# Altium schematic sheet Y181119---ArduinoNanoMCUATmega328P-DIP---9VDC.SchDoc
size 420 x 297 mm; Ratio: 1:1; Method: CĐ 00 00; PageTitle1: Page Title1; PageTitle2: Page Title2; Application_Tool: Altium Designer; AuthorSignature: Name; DesignerSignature: Name; DrawnBySignature: Name; CheckBySignature: Name; ApproveBySignature: Name; Step1: Design base; Step2: Technical design; Step3: Construction drawings
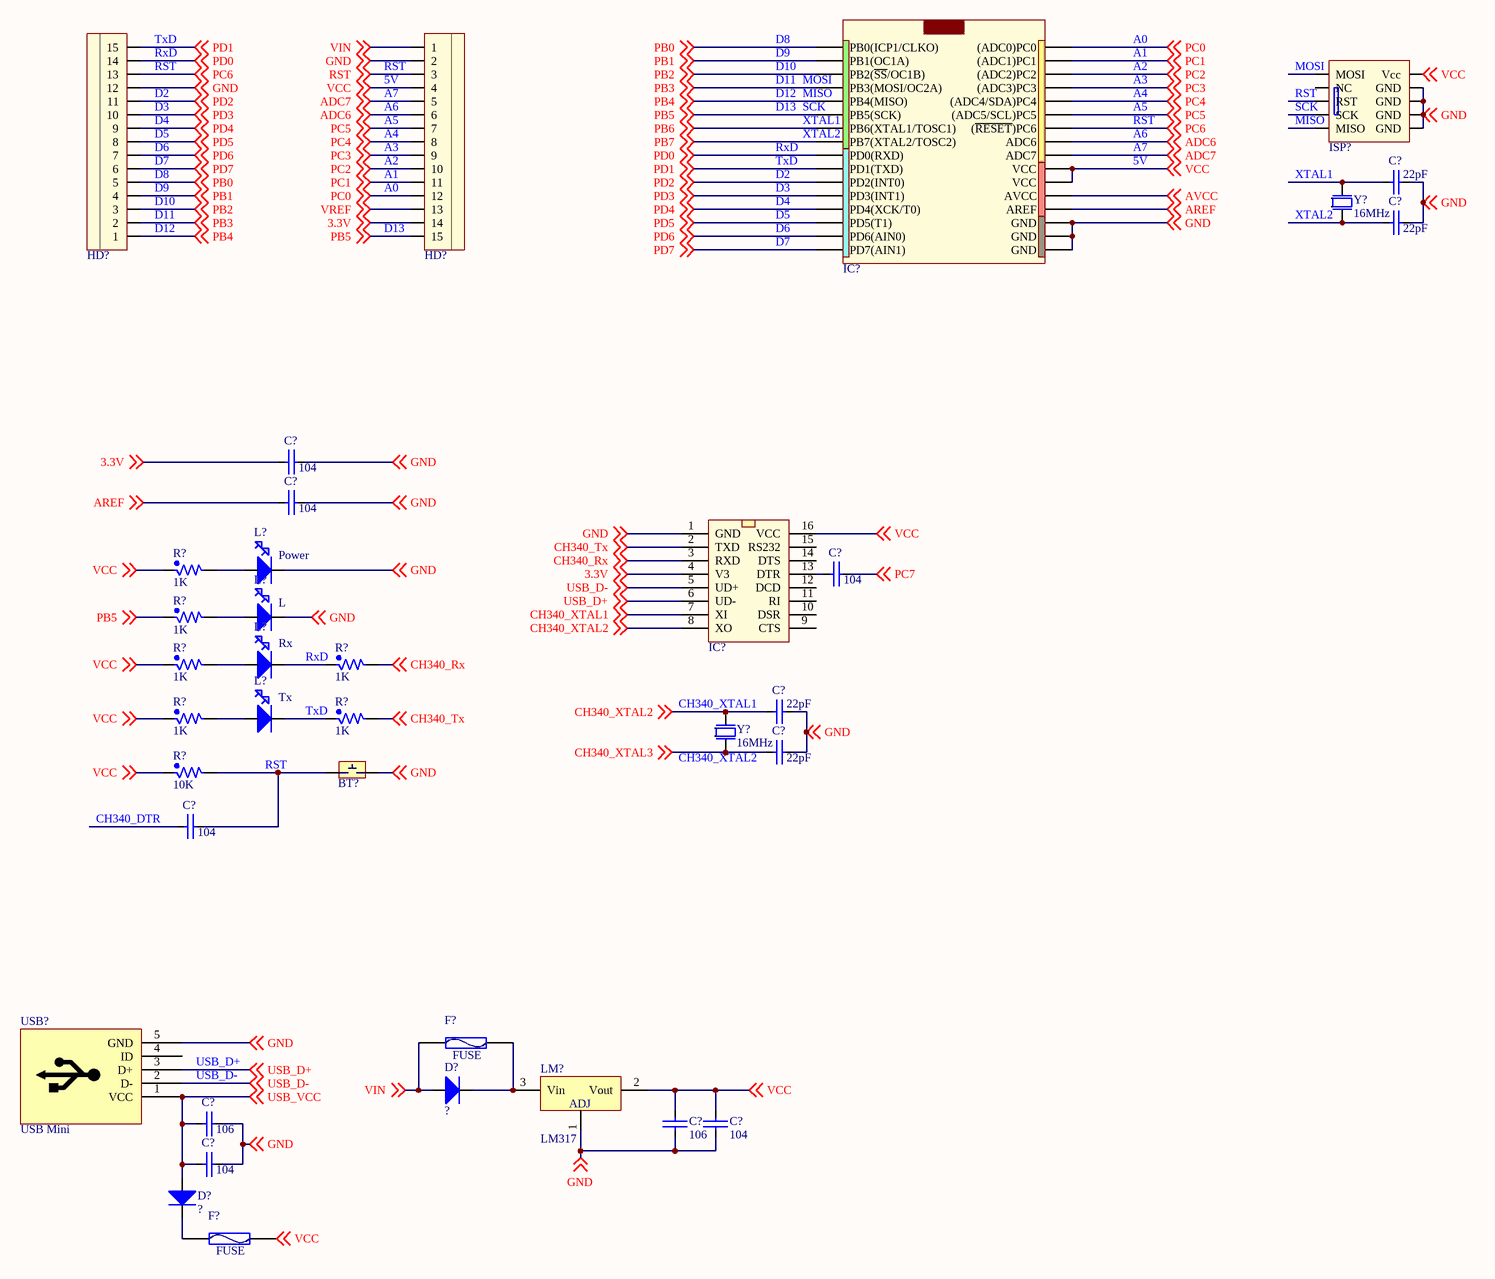
[diagram p0: Y181119---ArduinoNanoMCUATmega328P-DIP---9VDC.SchDoc]

## Parts
(Parts that share a designator on the sheet are numbered #1, #2 ... from top to bottom, then left to right.)
BT?  SW  [Button-2-SMD]  (value not drawn)
C?#1  22pF  [CAP-0805]
C?#2  22pF  [CAP-0805]
C?#3  104  [CAP-0805]
C?#4  104  [CAP-0805]
C?#5  104  [CAP-0805]
C?#6  22pF  [CAP-0805]
C?#7  22pF  [CAP-0805]
C?#8  104  [CAP-0805]
C?#9  106  [CAP-0805]
C?#10  106  [CAP-0805]
C?#11  104  [CAP-0805]
C?#12  104  [CAP-0805]
D?#1  ?  [DIODE-SMDV1]
D?#2  ?  [DIODE-SMDV1]
F?#1  FUSE  [FUSE-SMD-V0]
F?#2  FUSE  [FUSE-SMD-V0]
HD?#1  Header15  [JUMP-12x1]  (value not drawn)
HD?#2  Header15  [JUMP-12x1]  (value not drawn)
IC?#1  ATmega328P  [TQFP32-Package]  (value not drawn)
IC?#2  CH340  [SOP16-Package-V1]  (value not drawn)
ISP?  ISP V0  [IDE5x2-V0]  (value not drawn)
L?#1  Power  [LED-SMD]
L?#2  L  [LED-SMD]
L?#3  Rx  [LED-SMD]
L?#4  Tx  [LED-SMD]
LM?  LM317  [SOT223-4]
R?#1  1K  [Resistor-Package-0805]
R?#2  1K  [Resistor-Package-0805]
R?#3  1K  [Resistor-Package-0805]
R?#4  1K  [Resistor-Package-0805]
R?#5  1K  [Resistor-Package-0805]
R?#6  1K  [Resistor-Package-0805]
R?#7  10K  [Resistor-Package-0805]
USB?  USB Mini  [USB-MINI-SMD]
Y?#1  16MHz  [XT-V4]
Y?#2  16MHz  [XT-V4]

## Nets
3.3V: C?#3.1 HD?#2.14 IC?#2.4(V3) ; off-sheet 3.3V
5V: C?#10.2 C?#11.2 F?#2.2 HD?#2.4 IC?#1.4(VCC) IC?#1.6(VCC) IC?#2.16(VCC) ISP?.2(Vcc) LM?.2(Vout) R?#1.1 R?#3.1 R?#5.1 R?#7.1 ; off-sheet VCC  [also labelled VCC]
A0: HD?#2.12 IC?#1.23((ADC0)PC0) ; off-sheet PC0  [also labelled PC0]
A1: HD?#2.11 IC?#1.24((ADC1)PC1) ; off-sheet PC1  [also labelled PC1]
A2: HD?#2.10 IC?#1.25((ADC2)PC2) ; off-sheet PC2  [also labelled PC2]
A3: HD?#2.9 IC?#1.26((ADC3)PC3) ; off-sheet PC3  [also labelled PC3]
A4: HD?#2.8 IC?#1.27((ADC4/SDA)PC4) ; off-sheet PC4  [also labelled PC4]
A5: HD?#2.7 IC?#1.28((ADC5/SCL)PC5) ; off-sheet PC5  [also labelled PC5]
A6: HD?#2.6 IC?#1.19(ADC6) ; off-sheet ADC6  [also labelled ADC6]
A7: HD?#2.5 IC?#1.22(ADC7) ; off-sheet ADC7  [also labelled ADC7]
AREF: C?#4.1 IC?#1.20(AREF) ; off-sheet AREF
AVCC: IC?#1.18(AVCC) ; off-sheet AVCC
CH340_DTR: C?#8.1
CH340_Rx: IC?#2.3(RXD) R?#4.2 ; off-sheet CH340_Rx
CH340_Tx: IC?#2.2(TXD) R?#6.2 ; off-sheet CH340_Tx
CH340_XTAL1: C?#6.1 IC?#2.7(XI) IC?#2.8(XO) Y?#2.1(OSC1) ; off-sheet CH340_XTAL1, off-sheet CH340_XTAL2  [also labelled CH340_XTAL2]
CH340_XTAL3: C?#7.1 Y?#2.2(OSC2) ; off-sheet CH340_XTAL3
D2: HD?#1.11 IC?#1.32(PD2(INT0)) ; off-sheet PD2  [also labelled PD2]
D3: HD?#1.10 IC?#1.1(PD3(INT1)) ; off-sheet PD3  [also labelled PD3]
D4: HD?#1.9 IC?#1.2(PD4(XCK/T0)) ; off-sheet PD4  [also labelled PD4]
D5: HD?#1.8 IC?#1.9(PD5(T1)) ; off-sheet PD5  [also labelled PD5]
D6: HD?#1.7 IC?#1.10(PD6(AIN0)) ; off-sheet PD6  [also labelled PD6]
D7: HD?#1.6 IC?#1.11(PD7(AIN1)) ; off-sheet PD7  [also labelled PD7]
D8: HD?#1.5 IC?#1.12(PB0(ICP1/CLKO)) ; off-sheet PB0  [also labelled PB0]
D9: HD?#1.4 IC?#1.13(PB1(OC1A)) ; off-sheet PB1  [also labelled PB1]
D10: HD?#1.3 IC?#1.14(PB2(~{SS}/OC1B)) ; off-sheet PB2  [also labelled PB2]
D11: HD?#1.2 IC?#1.15(PB3(MOSI/OC2A)) ISP?.1(MOSI) ; off-sheet PB3  [also labelled MOSI, PB3]
D12: HD?#1.1 IC?#1.16(PB4(MISO)) ISP?.9(MISO) ; off-sheet PB4  [also labelled MISO, PB4]
D13: HD?#2.15 IC?#1.17(PB5(SCK)) ISP?.7(SCK) R?#2.1 ; off-sheet PB5  [also labelled PB5, SCK]
GND: BT?.2 C?#1.2 C?#2.2 C?#3.2 C?#4.2 C?#6.2 C?#7.2 C?#9.2 C?#10.1 C?#11.1 C?#12.2 HD?#1.12 HD?#2.2 IC?#1.3(GND) IC?#1.5(GND) IC?#1.21(GND) IC?#2.1(GND) ISP?.4(GND) ISP?.6(GND) ISP?.8(GND) ISP?.10(GND) L?#1.2(K) L?#2.2(K) LM?.1 USB?.5(GND) ; off-sheet GND
PC7: C?#5.2 ; off-sheet PC7
RST: BT?.1 C?#8.2 HD?#1.13 HD?#2.3 IC?#1.1((~{RESET})PC6) ISP?.5(RST) R?#7.2 ; off-sheet PC6, off-sheet RST  [also labelled PC6]
RxD: HD?#1.14 IC?#1.30(PD0(RXD)) L?#3.2(K) R?#4.1 ; off-sheet PD0  [also labelled PD0]
TxD: HD?#1.15 IC?#1.31(PD1(TXD)) L?#4.2(K) R?#6.1 ; off-sheet PD1  [also labelled PD1]
USB_D+: IC?#2.6(UD-) USB?.3(D+) ; off-sheet USB_D+
USB_D-: IC?#2.5(UD+) USB?.2(D-) ; off-sheet USB_D-
USB_VCC: C?#9.1 C?#12.1 D?#2.1(+) USB?.1(VCC) ; off-sheet USB_VCC
VIN: D?#1.1(+) F?#1.1 HD?#2.1 ; off-sheet VIN
VREF: HD?#2.13 ; off-sheet VREF
XTAL1: C?#1.1 IC?#1.7(PB6(XTAL1/TOSC1)) Y?#1.1(OSC1) ; off-sheet PB6  [also labelled PB6]
XTAL2: C?#2.1 IC?#1.8(PB7(XTAL2/TOSC2)) Y?#1.2(OSC2) ; off-sheet PB7  [also labelled PB7]
NetC?#5_1: C?#5.1 IC?#2.13(DTR)
NetD?#1_2: D?#1.2(-) F?#1.2 LM?.3(Vin)
NetD?#2_2: D?#2.2(-) F?#2.1
NetL?#1_1: L?#1.1(A) R?#1.2
NetL?#2_1: L?#2.1(A) R?#2.2
NetL?#3_1: L?#3.1(A) R?#3.2
NetL?#4_1: L?#4.1(A) R?#5.2

Not connected (* = marked no-connect by the designer): IC?#2 9(CTS) 10(DSR) 11(RI) 12(DCD) 14(DTS) 15(RS232); ISP? 3(NC); USB? 4(ID); Y?#1 3 4; Y?#2 3 4

## Notes on the sheet
- Labels drawn without touching a wire or pin: CH340_XTAL2
- Revision:
- Design company:
- Year:
- Step:
- Drawing Title:
- City:
- Country:
- Descriptions:
- Designer
- Author
- Page Title:
- Ratio
- Sheet
- Tool design:
- Tool version:
- Sheet number
- Drawn by
- Checked by
- Approve by
- Date
- (in symbol Buck LM1117 V0) ADJ

## Library data of the parts
BT? = Button
C?#1 C?#2 C?#6 C?#7 = Cap: value1: 33pF; value4: 1uF-105; value3: 0.1uF-100nF-104; value5: 10uF-106; value2: 0.01uF-103; value: 22pF
C?#3-C?#5 C?#8-C?#12 = Cap: value1: 33pF; value4: 1uF-105; value: 22pF; value3: 0.1uF-100nF-104; value5: 10uF-106; value2: 0.01uF-103
D?#1 D?#2 = Diode V0: 1N4007: 3A-1000V; 1N5822: SS34-3A-40V; 1N5819: SS14-1A-40V; FR107: 1A-1000V; FR307: 3A-1000V; 1N5408: 1A-1000V
F?#1 F?#2 = Furs
IC?#1 = MCU-ATmega328P-TQFP32
IC?#2 = CH340 G
L?#1-L?#4 = LED
LM? = Buck LM1117 V0: 1A IN(20V) OUT(1.25-13.8V)
R?#1-R?#7 = Resistor V0
Y?#1 Y?#2 = Crystal